# Altium project 3Dhoter_Project.PrjPcb
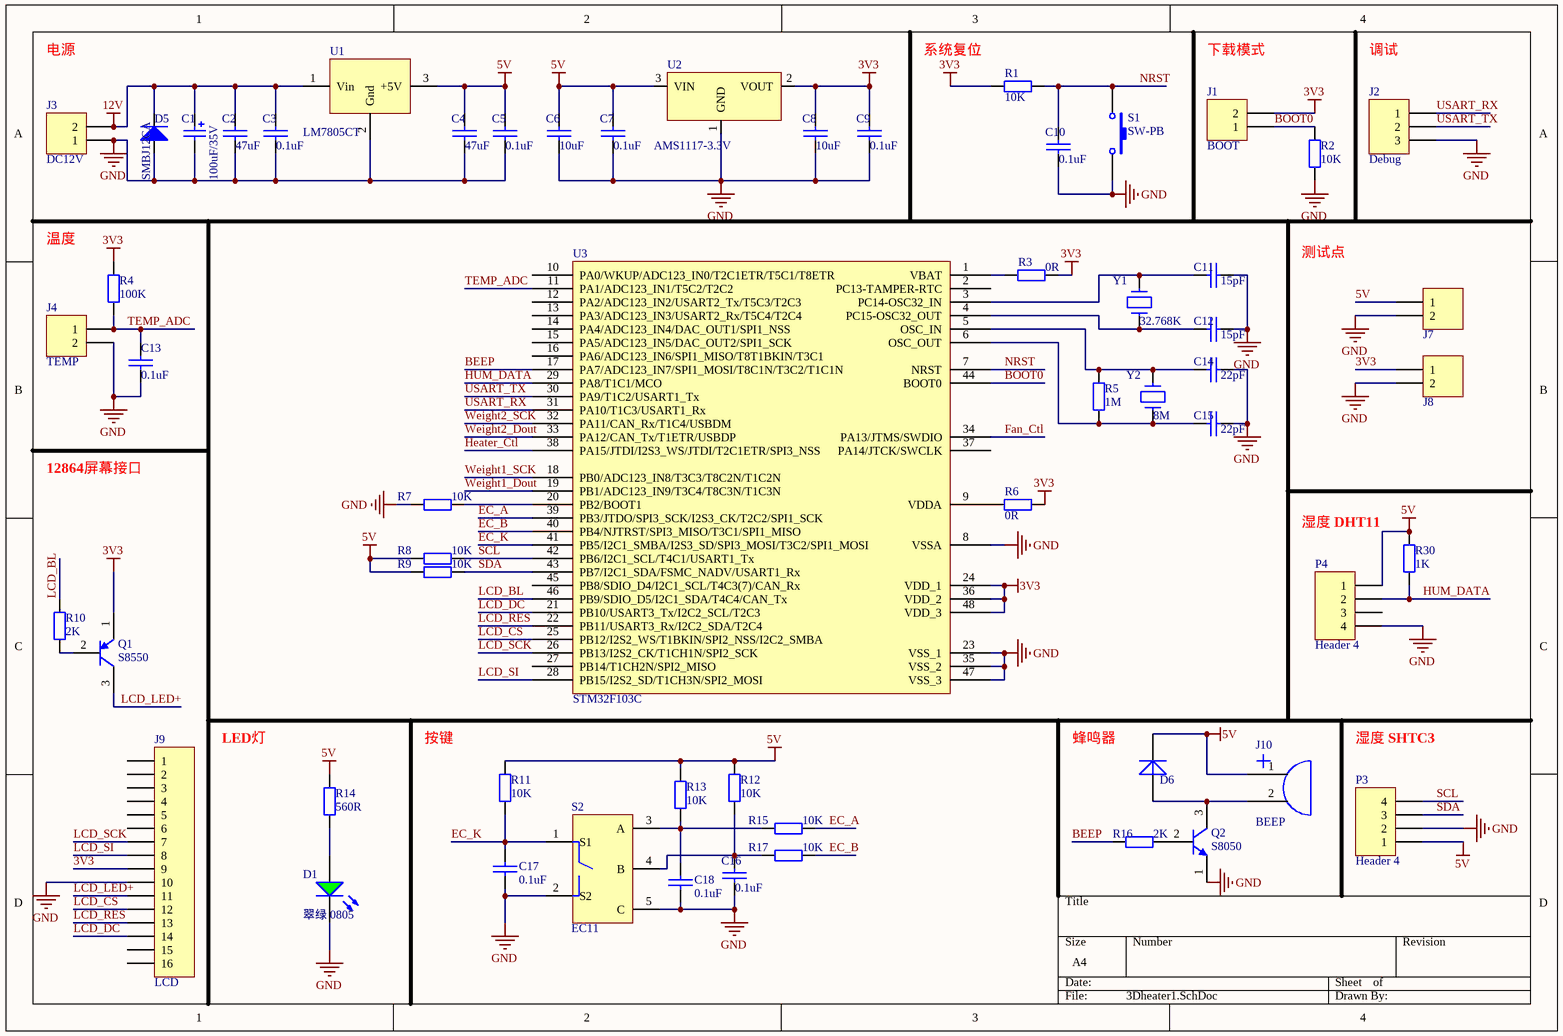
[diagram p0: 3Dheater1.SchDoc]
3 sheets, 91 parts. Net scope: global (net labels, ports and power ports of the same name join across sheets).
Board file: Heater.PcbDoc
Sheets:
  3Dheater1.SchDoc
  3Dheater2.SchDoc
  3Dheater3.SchDoc

## Sheet 3Dheater1.SchDoc: 3D printer
size A4; Revision: V1.0; SheetNumber: 1; Time: 2020/06/26

### Parts
C1  100uF/35V  [ELCO Case D]
C2  47uF  [1206]
C3  0.1uF  [C0805]
C4  47uF  [C0805]
C5  0.1uF  [C0805]
C6  10uF  [C0805]
C7  0.1uF  [C0805]
C8  10uF  [C0805]
C9  0.1uF  [C0805]
C10  0.1uF  [C0805]
C11  15pF  [C0805]
C12  15pF  [C0805]
C13  0.1uF  [C0805]
C14  22pF  [C0805]
C15  22pF  [C0805]
C16  0.1uF  [C0805]
C17  0.1uF  [C0805]
C18  0.1uF  [C0805]
D1  翠绿 0805  [0805_LED_S1]
D5  Type: SMBJ12CA  [DO214AA (SMB)]  (hidden comment: TVS)
D6  S1G  [DO214AC (SMA)]  (value not drawn)
J1  BOOT  [HDR1X2]
J2  Debug  [HDR1X3]
J3  DC12V  [HDR1X2_396]
J4  TEMP  [HDR1X2]
J7  Header 2  [HDR1X2]  (value not drawn)
J8  Header 2  [HDR1X2]  (value not drawn)
J9  LCD  [LCD12864]
J10  BEEP  [BELL-5]
P3  Header 4  [HDR1X4]
P4  Header 4  [HDR1X4]
Q1  S8550  [SOT-23-3L]
Q2  S8050  [SOT-23-3L]
R1  10K  [R0805]
R2  10K  [R0805]
R3  0R  [R0805]
R4  100K  [R0805]
R5  1M  [R0805]
R6  0R  [R0805]
R7  10K  [R0805]
R8  10K  [R0805]
R9  10K  [R0805]
R10  2K  [R0805]
R11  10K  [R0805]
R12  10K  [R0805]
R13  10K  [R0805]
R14  560R  [R0805]
R15  10K  [R0805]
R16  2K  [R0805]
R17  10K  [R0805]
R30  1K  [R0805]
S1  SW-PB  [SW-PB2]
S2  EC11  [EC11]
U1  LM7805CT  [TO-252-2-180]
U2  AMS1117-3.3V  [SOT-223]
U3  STM32F103C  [LQFP48_L]
Y1  32.768K  [XTAL32]
Y2  8M  [XTAL_US]

### Nets
3V3: C8.2 C9.2 J1.2 J8.1 J9.9 Q1.1(E) R1.2 R3.1 R4.1 R6.1 U2.2(VOUT) U3.24(VDD_1) U3.36(VDD_2) U3.48(VDD_3)
5V: C4.2 C5.2 C6.2 C7.2 D6.2(K) J7.1 J10.1 P3.1 P4.1 R8.1 R9.1 R11.2 R12.2 R13.2 R14.2 R30.1 U1.3(+5V) U2.3(VIN)
12V: C1.1 C2.2 C3.2 D5.2(K) J3.2 U1.1(Vin)
GND: C1.2 C2.1 C3.1 C4.1 C5.1 C6.1 C7.1 C8.1 C9.1 C10.1 C11.2 C12.2 C13.1 C14.2 C15.2 C16.1 C17.1 C18.1 D1.K D5.1(A) J2.3 J3.1 J4.2 J7.2 J8.2 J9.10 P3.2 P4.4 Q2.1(E) R2.2 R7.2 S1.2 S2.2(S2) S2.5(C) U1.2(Gnd) U2.1(GND) U3.8(VSSA) U3.23(VSS_1) U3.35(VSS_2) U3.47(VSS_3)
BEEP: R16.2 U3.17(PA7/ADC123_IN7/SPI1_MOSI/T8C1N/T3C2/T1C1N)
BOOT0: J1.1 R2.1 U3.44(BOOT0)
EC_A: R15.1 U3.39(PB3/JTDO/SPI3_SCK/I2S3_CK/T2C2/SPI1_SCK)
EC_B: R17.1 U3.40(PB4/NJTRST/SPI3_MISO/T3C1/SPI1_MISO)
EC_K: C17.2 R11.1 S2.1(S1) U3.41(PB5/I2C1_SMBA/I2S3_SD/SPI3_MOSI/T3C2/SPI1_MOSI)
Fan_Ctl: U3.34(PA13/JTMS/SWDIO)
Heater_Ctl: U3.38(PA15/JTDI/I2S3_WS/JTDI/T2C1ETR/SPI3_NSS)
HUM_DATA: P4.2 R30.2 U3.29(PA8/T1C1/MCO)
LCD_BL: R10.1 U3.46(PB9/SDIO_D5/I2C1_SDA/T4C4/CAN_Tx)
LCD_CS: J9.12 U3.25(PB12/I2S2_WS/T1BKIN/SPI2_NSS/I2C2_SMBA)
LCD_DC: J9.14 U3.21(PB10/USART3_Tx/I2C2_SCL/T2C3)
LCD_LED+: J9.11 Q1.3(C)
LCD_RES: J9.13 U3.22(PB11/USART3_Rx/I2C2_SDA/T2C4)
LCD_SCK: J9.7 U3.26(PB13/I2S2_CK/T1CH1N/SPI2_SCK)
LCD_SI: J9.8 U3.28(PB15/I2S2_SD/T1CH3N/SPI2_MOSI)
NRST: C10.2 R1.1 S1.1 U3.7(NRST)
SCL: P3.4 R8.2 U3.42(PB6/I2C1_SCL/T4C1/USART1_Tx)
SDA: P3.3 R9.2 U3.43(PB7/I2C1_SDA/FSMC_NADV/USART1_Rx)
TEMP_ADC: C13.2 J4.1 R4.2 U3.11(PA1/ADC123_IN1/T5C2/T2C2)
USART_RX: J2.1 U3.31(PA10/T1C3/USART1_Rx)
USART_TX: J2.2 U3.30(PA9/T1C2/USART1_Tx)
Weight1_Dout: U3.19(PB1/ADC123_IN9/T3C4/T8C3N/T1C3N)
Weight1_SCK: U3.18(PB0/ADC123_IN8/T3C3/T8C2N/T1C2N)
Weight2_Dout: U3.33(PA12/CAN_Tx/T1ETR/USBDP)
Weight2_SCK: U3.32(PA11/CAN_Rx/T1C4/USBDM)
NetC11_1: C11.1 U3.3(PC14-OSC32_IN) Y1.2
NetC12_1: C12.1 U3.4(PC15-OSC32_OUT) Y1.1
NetC14_1: C14.1 R5.2 U3.5(OSC_IN) Y2.2
NetC15_1: C15.1 R5.1 U3.6(OSC_OUT) Y2.1
NetC16_2: C16.2 R12.1 R17.2 S2.4(B)
NetC18_2: C18.2 R13.1 R15.2 S2.3(A)
NetD1_A: D1.A R14.1
NetD6_1: D6.1(A) J10.2 Q2.3(C)
NetQ1_2: Q1.2(B) R10.2
NetQ2_2: Q2.2(B) R16.1
NetR3_2: R3.2 U3.1(VBAT)
NetR6_2: R6.2 U3.9(VDDA)
NetR7_1: R7.1 U3.20(PB2/BOOT1)

Not connected (* = marked no-connect by the designer): J9 1 2 3 4 5 6 15 16; P4 3; U3 2(PC13-TAMPER-RTC) 10(PA0/WKUP/ADC123_IN0/T2C1ETR/T5C1/T8ETR) 12(PA2/ADC123_IN2/USART2_Tx/T5C3/T2C3) 13(PA3/ADC123_IN3/USART2_Rx/T5C4/T2C4) 14(PA4/ADC123_IN4/DAC_OUT1/SPI1_NSS) 15(PA5/ADC123_IN5/DAC_OUT2/SPI1_SCK) 16(PA6/ADC123_IN6/SPI1_MISO/T8T1BKIN/T3C1) 27(PB14/T1CH2N/SPI2_MISO) 37(PA14/JTCK/SWCLK) 45(PB8/SDIO_D4/I2C1_SCL/T4C3(7)/CAN_Rx)

### Notes on the sheet
- 电源
- 系统复位
- 下载模式
- 调试
- 温度
- 测试点
- 12864屏幕接口
- 湿度 DHT11
- LED灯
- 按键
- 蜂鸣器
- 湿度 SHTC3

### Library data of the parts
C1 = Capacitor Polarity: RO ELCO 100uF 20% 35V CASE-D EEEFP PAN; ID: Library_CAP-0004; Faber ItemCode: 36865800; Value: 100uF/35V
C2-C18 = CAP: Capacitor
D1 = 0805 翠绿: 发光二极管; ComponentLink1Description: 供应商链接; ComponentLink1URL: http://www.szlcsc.com/product/details_2670.html; Package: 0805; Supplier: LC; SuppliersPartNumber: C2297
D5 = TVS: TVS保护; Published: 8-Jun-2000; LatestRevisionDate: 17-Jul-2002; LatestRevisionNote: Re-released for DXP Platform.; PackageDocument: Sep-1996; PackageReference: SMC; Publisher: Altium Limited; Code_JEDEC: DO-214-AB
D6 = Library_DIO-0001: RO DIODE S1G DO-214AC; Faber ItemCode: 32284000; Info: Fast Rectifiers 1A 400V; ID: Library_DIO-0001; Value: S1G
J1 J4 = Header 2H: Header, 2-Pin, Right Angle; LatestRevisionDate: 17-Jul-2002; LatestRevisionNote: Re-released for DXP Platform.; Publisher: Altium Limited
J2 = Header 3: 接插件; LatestRevisionDate: 17-Jul-2002; LatestRevisionNote: Re-released for DXP Platform.; Publisher: Altium Limited
J3 J7 J8 = Header 2: 接插件; LatestRevisionDate: 17-Jul-2002; LatestRevisionNote: Re-released for DXP Platform.; Publisher: Altium Limited
J9 = Header 16: Header, 16-Pin; LatestRevisionDate: 17-Jul-2002; LatestRevisionNote: Re-released for DXP Platform.; Publisher: Altium Limited
J10 = BEEP: 蜂鸣器
P3 P4 = Header 4: Header, 4-Pin; LatestRevisionDate: 17-Jul-2002; LatestRevisionNote: Re-released for DXP Platform.; Publisher: Altium Limited
Q1 = S8550: PNP三极管; Published: 8-Jun-2000; LatestRevisionDate: 15-Jan-2003; LatestRevisionNote: PCB Footprint 'BCY-W3/D4.7' replaced; DatasheetDocument: 1997; PackageDocument: Sep-1998; PackageReference: TO-92A; Publisher: Altium Limited; Code_JEDEC: TO-92A; ComponentLink1Description: Manufacturer Link; ComponentLink1URL: http://www.fairchildsemi.com/; ComponentLink2Description: Datasheet; ComponentLink2URL: http://www.fairchildsemi.com/ds/2N%2F2N3906.pdf
Q2 = S8050: NPN三极管; Published: 8-Jun-2000; LatestRevisionDate: 15-Jan-2003; LatestRevisionNote: PCB Footprint 'BCY-W3/D4.7' replaced; DatasheetDocument: 1997; PackageDocument: Sep-1998; PackageReference: TO-92A; Publisher: Altium Limited; Code_JEDEC: TO-92A; ComponentLink1Description: Manufacturer Link; ComponentLink1URL: http://www.fairchildsemi.com/; ComponentLink2Description: Datasheet; ComponentLink2URL: http://www.fairchildsemi.com/ds/2N%2F2N3904.pdf
R1-R17 R30 = Res1: 贴片电阻; Published: 8-Jun-2000; LatestRevisionDate: 17-Jul-2002; LatestRevisionNote: Re-released for DXP Platform.; PackageReference: AXIAL-0.4; Publisher: Altium Limited
  R1 R2 R7-R9 R11-R13 R15 R17: Value: 10K
  R3 R6: Value: 0R
  R4: Value: 100K
  R5: Value: 1M
  R10 R16: Value: 2K
  R14: Value: 560R
  R30: Value: 1K
S1 = SW-PB: 微动开关; Published: 24-Mar-1999; LatestRevisionDate: 17-Jul-2002; LatestRevisionNote: Re-released for DXP Platform.; PackageReference: SPST-2; Publisher: Altium Limited
S2 = EC11: 旋转编码器
U2 = LM1117
U3 = STM32F103C: STM32单片机48引脚
Y1 Y2 = CRYSTAL

## Sheet 3Dheater2.SchDoc
size A4
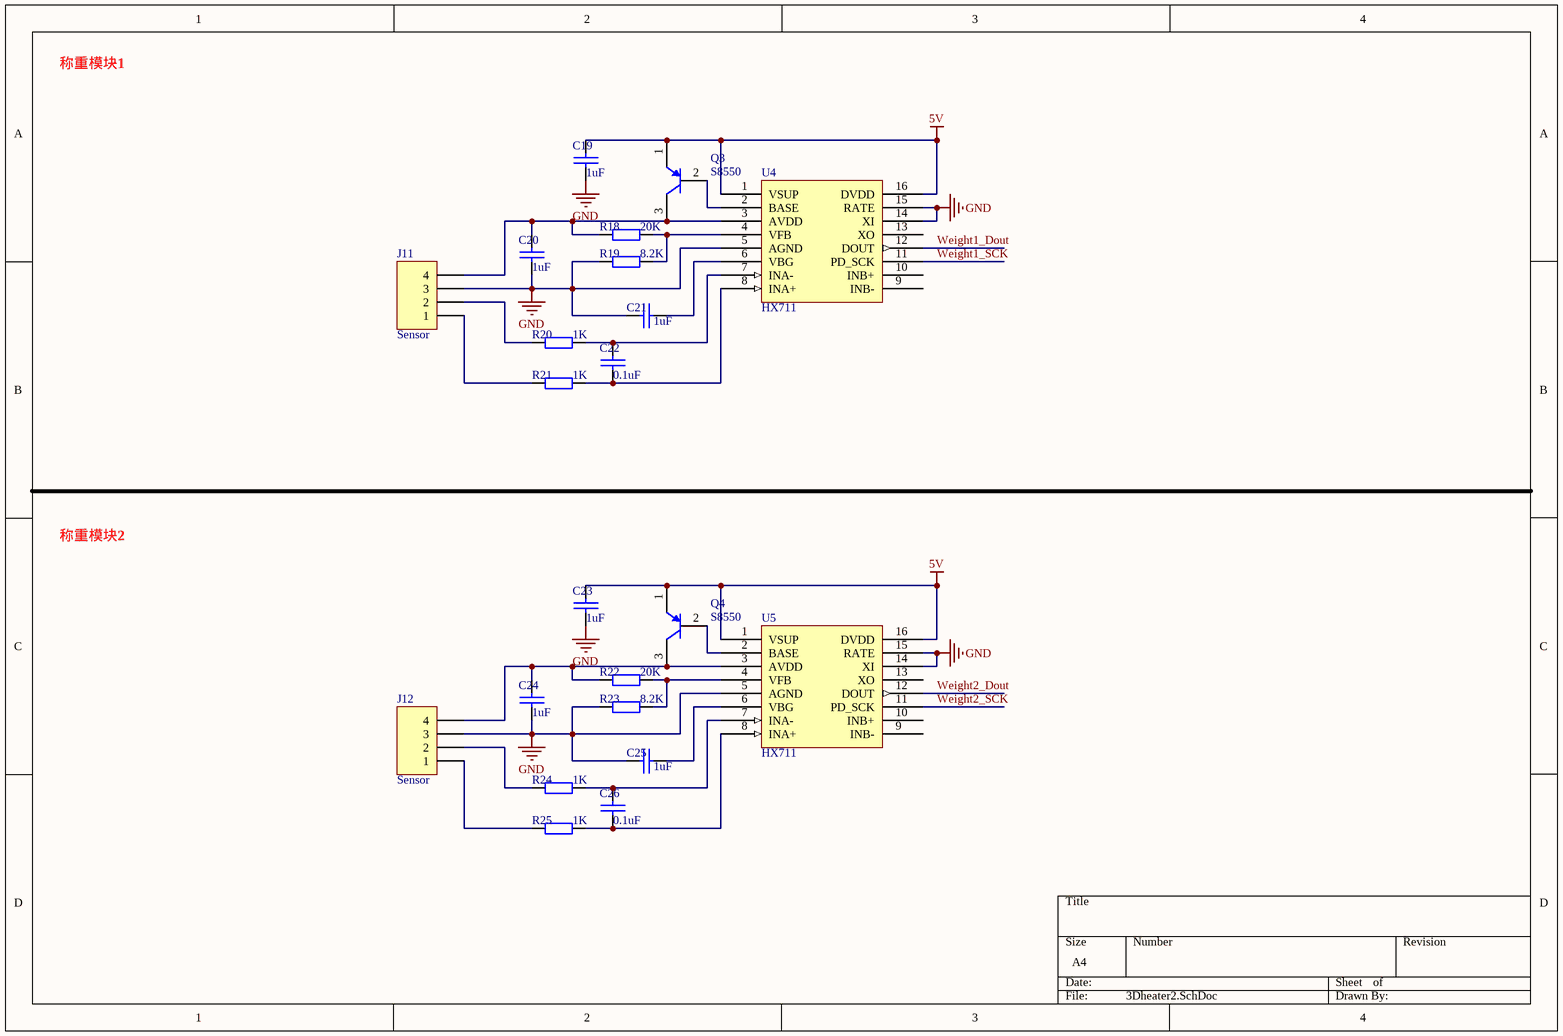
[diagram p1: 3Dheater2.SchDoc]

### Parts
C19  1uF  [C0805]
C20  1uF  [C0805]
C21  1uF  [C0805]
C22  0.1uF  [C0805]
C23  1uF  [C0805]
C24  1uF  [C0805]
C25  1uF  [C0805]
C26  0.1uF  [C0805]
J11  Sensor  [HDR1X4]
J12  Sensor  [HDR1X4]
Q3  S8550  [SOT-23-3L]
Q4  S8550  [SOT-23-3L]
R18  20K  [R0805]
R19  8.2K  [R0805]
R20  1K  [R0805]
R21  1K  [R0805]
R22  20K  [R0805]
R23  8.2K  [R0805]
R24  1K  [R0805]
R25  1K  [R0805]
U4  HX711  [SOP16M]
U5  HX711  [SOP16M]

### Nets
5V: C19.1 C23.1 Q3.1(E) Q4.1(E) U4.1(VSUP) U4.16(DVDD) U5.1(VSUP) U5.16(DVDD)
GND: C19.2 C20.1 C21.2 C23.2 C24.1 C25.2 J11.3 J12.3 R19.2 R23.2 U4.5(AGND) U4.14(XI) U4.15(RATE) U5.5(AGND) U5.14(XI) U5.15(RATE)
Weight1_Dout: U4.12(DOUT)
Weight1_SCK: U4.11(PD_SCK)
Weight2_Dout: U5.12(DOUT)
Weight2_SCK: U5.11(PD_SCK)
NetC20_2: C20.2 J11.4 Q3.3(C) R18.2 U4.3(AVDD)
NetC21_1: C21.1 U4.6(VBG)
NetC22_1: C22.1 R21.1 U4.8(INA+)
NetC22_2: C22.2 R20.1 U4.7(INA-)
NetC24_2: C24.2 J12.4 Q4.3(C) R22.2 U5.3(AVDD)
NetC25_1: C25.1 U5.6(VBG)
NetC26_1: C26.1 R25.1 U5.8(INA+)
NetC26_2: C26.2 R24.1 U5.7(INA-)
NetJ11_1: J11.1 R21.2
NetJ11_2: J11.2 R20.2
NetJ12_1: J12.1 R25.2
NetJ12_2: J12.2 R24.2
NetQ3_2: Q3.2(B) U4.2(BASE)
NetQ4_2: Q4.2(B) U5.2(BASE)
NetR18_1: R18.1 R19.1 U4.4(VFB)
NetR22_1: R22.1 R23.1 U5.4(VFB)

Not connected (* = marked no-connect by the designer): U4 9(INB-) 10(INB+) 13(XO); U5 9(INB-) 10(INB+) 13(XO)

### Notes on the sheet
- 称重模块1
- 称重模块2

### Library data of the parts
C19-C26 = CAP: Capacitor
J11 J12 = Header 4: Header, 4-Pin; LatestRevisionDate: 17-Jul-2002; LatestRevisionNote: Re-released for DXP Platform.; Publisher: Altium Limited
Q3 Q4 = S8550: PNP三极管; Published: 8-Jun-2000; LatestRevisionDate: 15-Jan-2003; LatestRevisionNote: PCB Footprint 'BCY-W3/D4.7' replaced; DatasheetDocument: 1997; PackageDocument: Sep-1998; PackageReference: TO-92A; Publisher: Altium Limited; Code_JEDEC: TO-92A; ComponentLink1Description: Manufacturer Link; ComponentLink1URL: http://www.fairchildsemi.com/; ComponentLink2Description: Datasheet; ComponentLink2URL: http://www.fairchildsemi.com/ds/2N%2F2N3906.pdf
R18-R25 = Res1: 贴片电阻; Published: 8-Jun-2000; LatestRevisionDate: 17-Jul-2002; LatestRevisionNote: Re-released for DXP Platform.; PackageReference: AXIAL-0.4; Publisher: Altium Limited
  R18 R22: Value: 20K
  R19 R23: Value: 8.2K
  R20 R21 R24 R25: Value: 1K
U4 U5 = HX711: AD转换

## Sheet 3Dheater3.SchDoc
size A4
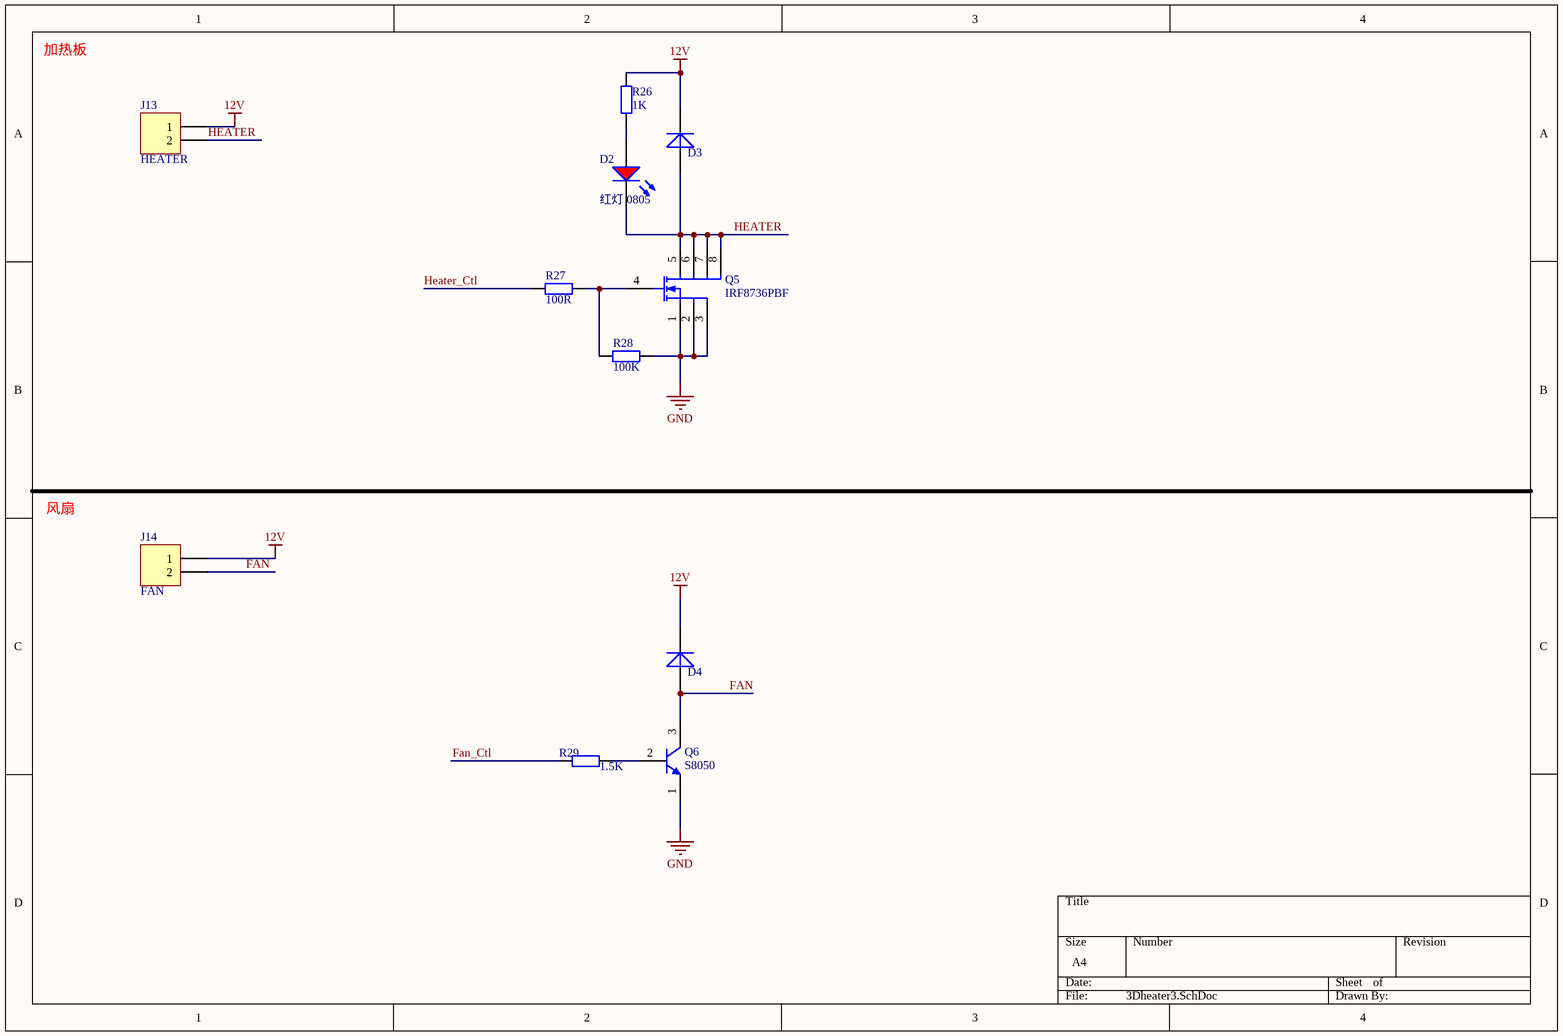
[diagram p2: 3Dheater3.SchDoc]

### Parts
D2  红灯 0805  [0805_LED_S1]
D3  S1G  [DO214AC (SMA)]  (value not drawn)
D4  S1G  [DO214AC (SMA)]  (value not drawn)
J13  HEATER  [HDR1X2]
J14  FAN  [HDR1X2]
Q5  IRF8736PBF  [SOIC127P600X175-8N (SO8)]
Q6  S8050  [SOT-23-3L]
R26  1K  [R0805]
R27  100R  [R0805]
R28  100K  [R0805]
R29  1.5K  [R0805]

### Nets
12V: D3.2(K) D4.2(K) J13.1 J14.1 R26.2
GND: Q5.1(S) Q5.2(S) Q5.3(S) Q6.1(E) R28.2
FAN: D4.1(A) J14.2 Q6.3(C)
Fan_Ctl: R29.2
HEATER: D2.K D3.1(A) J13.2 Q5.5(D) Q5.6(D) Q5.7(D) Q5.8(D)
Heater_Ctl: R27.1
NetD2_A: D2.A R26.1
NetQ5_4: Q5.4(G) R27.2 R28.1
NetQ6_2: Q6.2(B) R29.1

### Notes on the sheet
- 加热板
- 风扇

### Library data of the parts
D2 = 0805 红灯: 发光二极管; ComponentLink1Description: 供应商链接; ComponentLink1URL: http://www.szlcsc.com/product/details_2668.html; Package: 0805; Supplier: LC; SuppliersPartNumber: C2295
D3 D4 = Library_DIO-0001: as D6 on sheet 3Dheater1; ID: Library_DIO-0001; Value: S1G
J13 J14 = Header 2H: Header, 2-Pin, Right Angle; LatestRevisionDate: 17-Jul-2002; LatestRevisionNote: Re-released for DXP Platform.; Publisher: Altium Limited
Q5 = LIBRARY_FET-0002: IRF8736PBF - MOSFET, N SO-8; Mfg: INTERNATIONAL RECTIFIER; Info: HEXFET Power MOSFET; Faber ItemCode: 36926000; Mfg code: IRF8736PBF; ID: LIBRARY_FET-0002; Value: IRF8736PBF
Q6 = S8050: NPN三极管; Published: 8-Jun-2000; LatestRevisionDate: 15-Jan-2003; LatestRevisionNote: PCB Footprint 'BCY-W3/D4.7' replaced; DatasheetDocument: 1997; PackageDocument: Sep-1998; PackageReference: TO-92A; Publisher: Altium Limited; Code_JEDEC: TO-92A; ComponentLink1Description: Manufacturer Link; ComponentLink1URL: http://www.fairchildsemi.com/; ComponentLink2Description: Datasheet; ComponentLink2URL: http://www.fairchildsemi.com/ds/2N%2F2N3904.pdf
R26-R29 = Res1: 贴片电阻; Published: 8-Jun-2000; LatestRevisionDate: 17-Jul-2002; LatestRevisionNote: Re-released for DXP Platform.; PackageReference: AXIAL-0.4; Publisher: Altium Limited
  R26: Value: 1K
  R27: Value: 100R
  R28: Value: 100K
  R29: Value: 1.5K

## Nets that join several sheets
5V: 3Dheater1 (18 pins), 3Dheater2 (8 pins)
12V: 3Dheater1 (6 pins), 3Dheater3 (5 pins)
GND: 3Dheater1 (40 pins), 3Dheater2 (16 pins), 3Dheater3 (5 pins)
Fan_Ctl: 3Dheater1 (U3.34), 3Dheater3 (R29.2)
Heater_Ctl: 3Dheater1 (U3.38), 3Dheater3 (R27.1)
Weight1_Dout: 3Dheater1 (U3.19), 3Dheater2 (U4.12)
Weight1_SCK: 3Dheater1 (U3.18), 3Dheater2 (U4.11)
Weight2_Dout: 3Dheater1 (U3.33), 3Dheater2 (U5.12)
Weight2_SCK: 3Dheater1 (U3.32), 3Dheater2 (U5.11)